# EAGLE design OpenPCR-combined-blockfront (EAGLE 6.2)
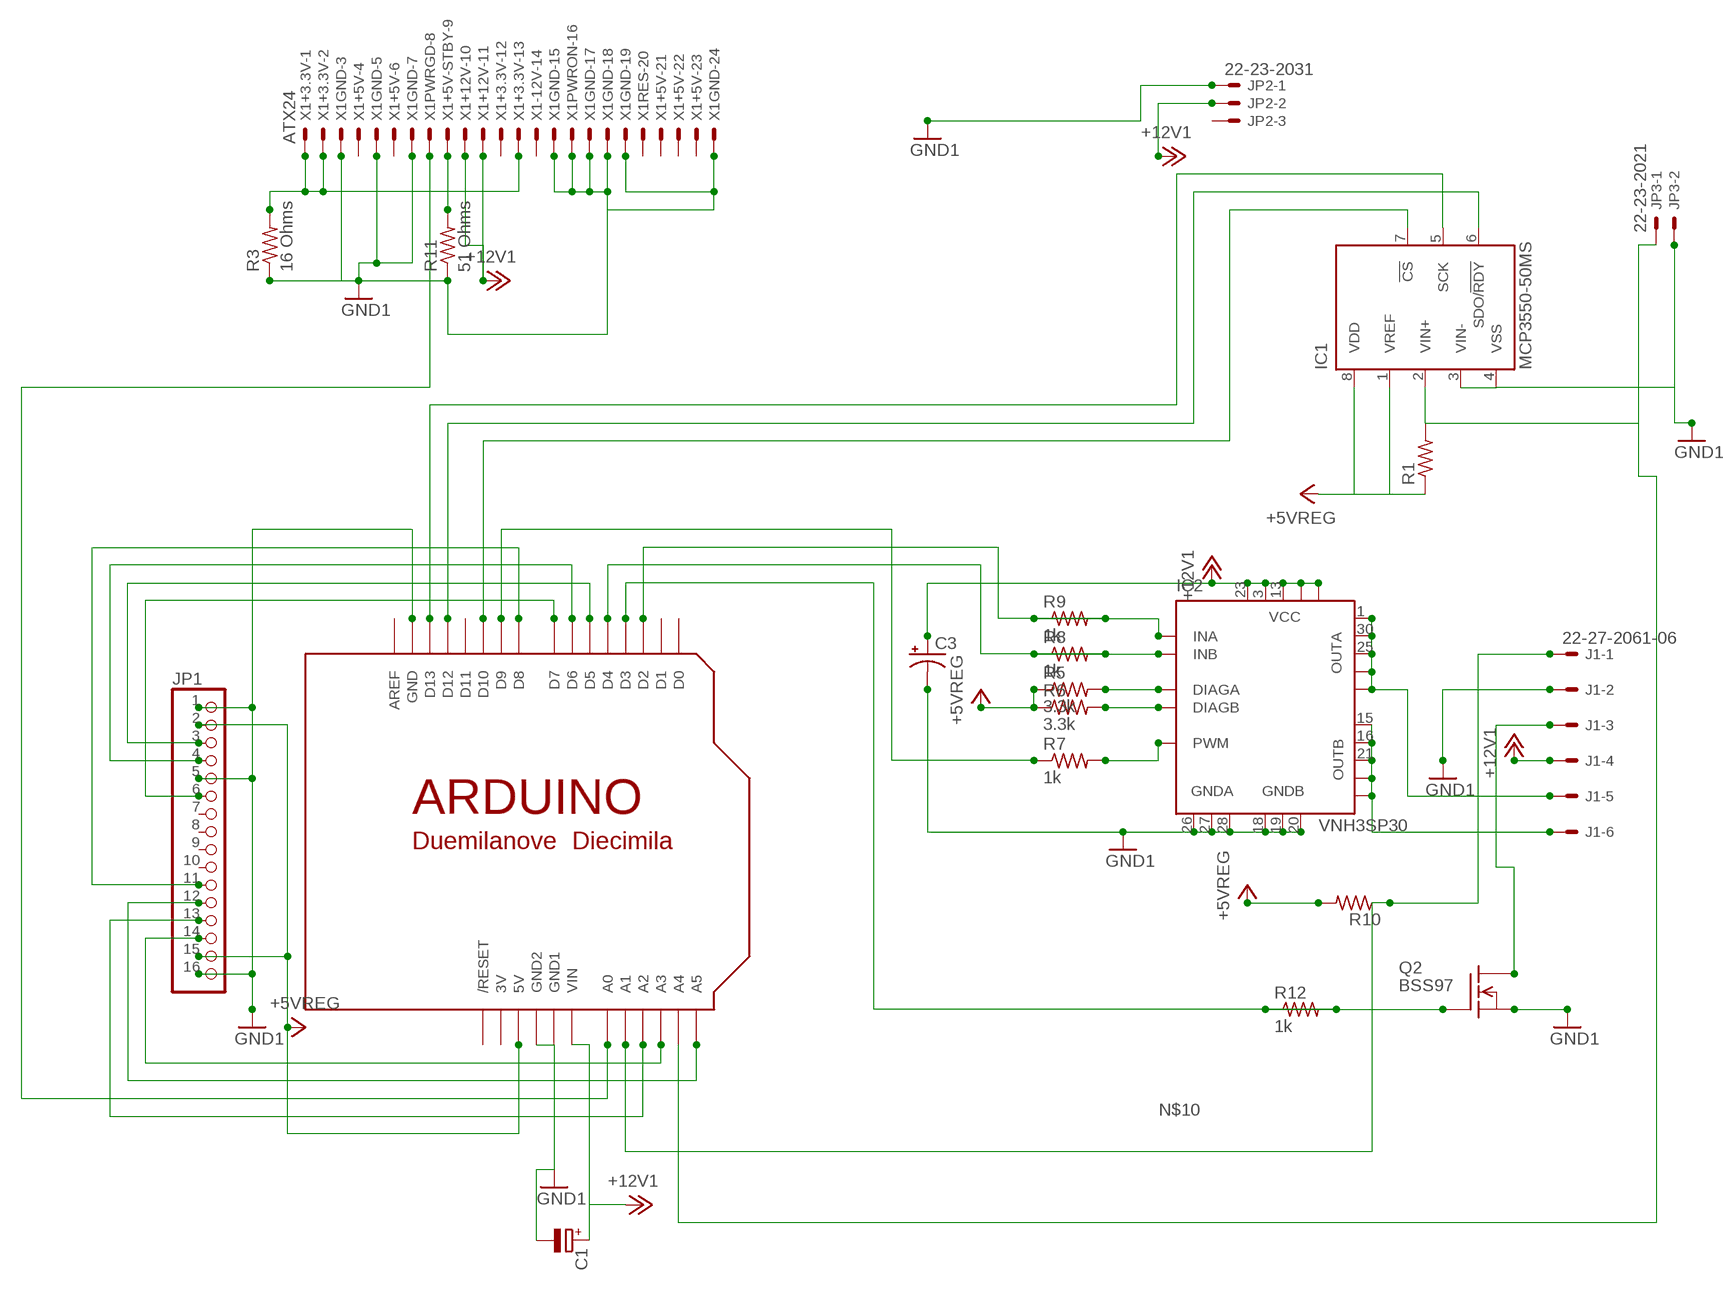
[diagram p0: schematic, sheet 1]

## Parts
C1  CPOL-EUE5-8.5  [E5-8,5]
C3  CPOL-USE5-13  [E5-13]
IC1  MCP3550-50MS  [MSOP8]
IC2  VNH3SP30  [MULTIPOWERSO-30]
J1  22-27-2061-06  [6410-06]
JP1  PINHD-1X16/90  [1X16/90]
JP2  22-23-2031  [22-23-2031]
JP3  22-23-2021  [22-23-2021]
Q2  BSS97  [TO202]
R1  R-US_0207/10  [0207/10]
R3  16 Ohms  R-US_0414/15  [0414/15]
R5  3.3k  R-US_R0603  [R0603]
R6  3.3k  R-US_R0603  [R0603]
R7  1k  R-US_R0603  [R0603]
R8  1k  R-US_R0603  [R0603]
R9  1k  R-US_R0603  [R0603]
R10  R-US_0207/10  [0207/10]
R11  51 Ohms  R-US_0207/12  [0207/12]
R12  1k  R-US_R0603  [R0603]
U$3  ARDUINODUEMILANOVE  [ARDUINO]
X1  ATX24  [ATX24]

## Nets
+3.3V [2A]: R3.2 X1.1 X1.2 X1.13
+5VREG [2A]: IC1.1(VREF) IC1.8(VDD) JP1.2 JP1.15 R1.1 R5.1 R6.1 R10.2 U$3.5V
+5VSTBY: R11.2 X1.9
+12V1: C1.+ C3.+ IC2.3(VCC) IC2.13(VCC) IC2.23(VCC) IC2.VCC IC2.VCC@1(VCC) J1.4 JP2.2 U$3.VIN X1.10 X1.11
GND1: C1.- C3.- IC1.3(VIN-) IC1.4(VSS) IC2.18(GNDB) IC2.19(GNDB) IC2.20(GNDB) IC2.26(GNDA) IC2.27(GNDA) IC2.28(GNDA) J1.2 JP1.1 JP1.5 JP1.16 JP2.1 JP3.2 Q2.1(S) R3.1 R11.1 U$3.GND U$3.GND1 U$3.GND2 X1.3 X1.5 X1.7 X1.15 X1.16 X1.17 X1.18 X1.19 X1.24
N$1: U$3.A0 X1.8
N$2: JP1.3 U$3.D5
N$3: JP1.4 U$3.D6
N$4: JP1.14 U$3.A3
N$6: IC2.11(INB) R8.1
N$8: R12.2 U$3.D3
N$10: JP1.13 U$3.A2
N$11: JP1.6 U$3.D7
N$12: JP1.12 U$3.A5
N$14: IC1.5(SCK) U$3.D13
N$16: IC2.8(PWM) R7.2
N$18 [3A]: J1.3 Q2.2(D)
N$19: IC2.5(INA) R9.1
N$20: JP1.11 U$3.D8
N$22: IC1.2(VIN+) JP3.1 R1.2 U$3.A4
N$25 [2A]: IC2.1(OUTA) IC2.25(OUTA) IC2.30(OUTA) IC2.OUTA IC2.OUTA@1(OUTA) J1.5
N$27: IC1.6(SDO/!RDY) U$3.D12
N$29: IC1.7(!CS) U$3.D10
N$30: R7.1 U$3.D9
N$31: R8.2 U$3.D4
N$32 [8A]: IC2.15(OUTB) IC2.16(OUTB) IC2.21(OUTB) IC2.OUTB IC2.OUTB@1(OUTB) J1.6
N$33: R9.2 U$3.D2
N$34: IC2.6(DIAGA) R5.2
N$35: IC2.10(DIAGB) R6.2
N$37: J1.1 R10.1 U$3.A1
T1: Q2.3(G) R12.1
Unconnected: JP1.7 JP1.8 JP1.9 JP1.10 JP2.3 U$3.AREF U$3.D0 U$3.D1 U$3.D11 U$3.RESET(/RESET) X1.4 X1.6 X1.12 X1.14 X1.20 X1.21 X1.22 X1.23

## Power pins joined to a net without a drawn wire
3V: U$3.3V

## Library data of the parts
C1 = rcl:CPOL-EU: POLARIZED CAPACITOR, European symbol
C3 = rcl:CPOL-US: POLARIZED CAPACITOR, American symbol
IC1 = microchip:MCP355*: Low-Power, Single-Channel 22-Bit Delta-Sigma ADCs Source: http://ww1.microchip.com/downloads/en/DeviceDoc/21950c.pdf; MF: MICROCHIP; MPN: MCP3550-50E/MS; OC_FARNELL: 1627198; OC_NEWARK: 69K0130
IC2 = st-microelectronics:VNH3SP30: FULLY INTEGRATED H-BRIDGE MOTOR DRIVER Source: http://pdf1.alldatasheet.com/datasheet-pdf/view/84563/STMICROELECTRONICS/VNH3SP30.html; MPN: VNH3SP30-E; OC_FARNELL: 1739420; OC_NEWARK: 33R1486
J1 = con-molex:22-?-06: CONNECTOR wire to board 2.54 mm (.1 inch) pitch header; OC_FARNELL: unknown; OC_NEWARK: unknown
JP1 = pinhead:PINHD-1X16: PIN HEADER
JP2 = con-molex:22-23-2031: .100" (2.54mm) Center Header - 3 Pin; MF: MOLEX; MPN: 22-23-2031; OC_FARNELL: 1462950; OC_NEWARK: 30C0862
JP3 = con-molex:22-23-2021: .100" (2.54mm) Center Header - 2 Pin; MF: MOLEX; MPN: 22-23-2021; OC_FARNELL: 1462926; OC_NEWARK: 25C3832
Q2 = openpcr:BSS97: N-Channel Enhancement MOSFET 200V; 1.5A; 1,6Ohm
R1 R3 R10 = resistor:R-US_: RESISTOR, American symbol
R5-R9 R11 R12 = rcl:R-US_: RESISTOR, American symbol
U$3 = openpcr:ARDUINO: Arduino Diecimila/Duemilanove Make a shield with ease, this package has all the named pins as well as the two mounting drill holes and an outline of the USB and DC power connector. The outline is on the DIMENSION layer, so if your board house uses it they will cut the outline to match. http://www.ladyada.net/library/pcb/eaglelibrary.html
X1 = openpcr:ATX24: Mini FIT connector 24 pol Source: http://www.molex.com; OC_FARNELL: unknown; OC_NEWARK: unknown

## Net classes
0 default: width 0.381 mm
1 2A: width 0.762 mm
2 8A: width 2.54 mm
3 3A: width 1.016 mm

## Board
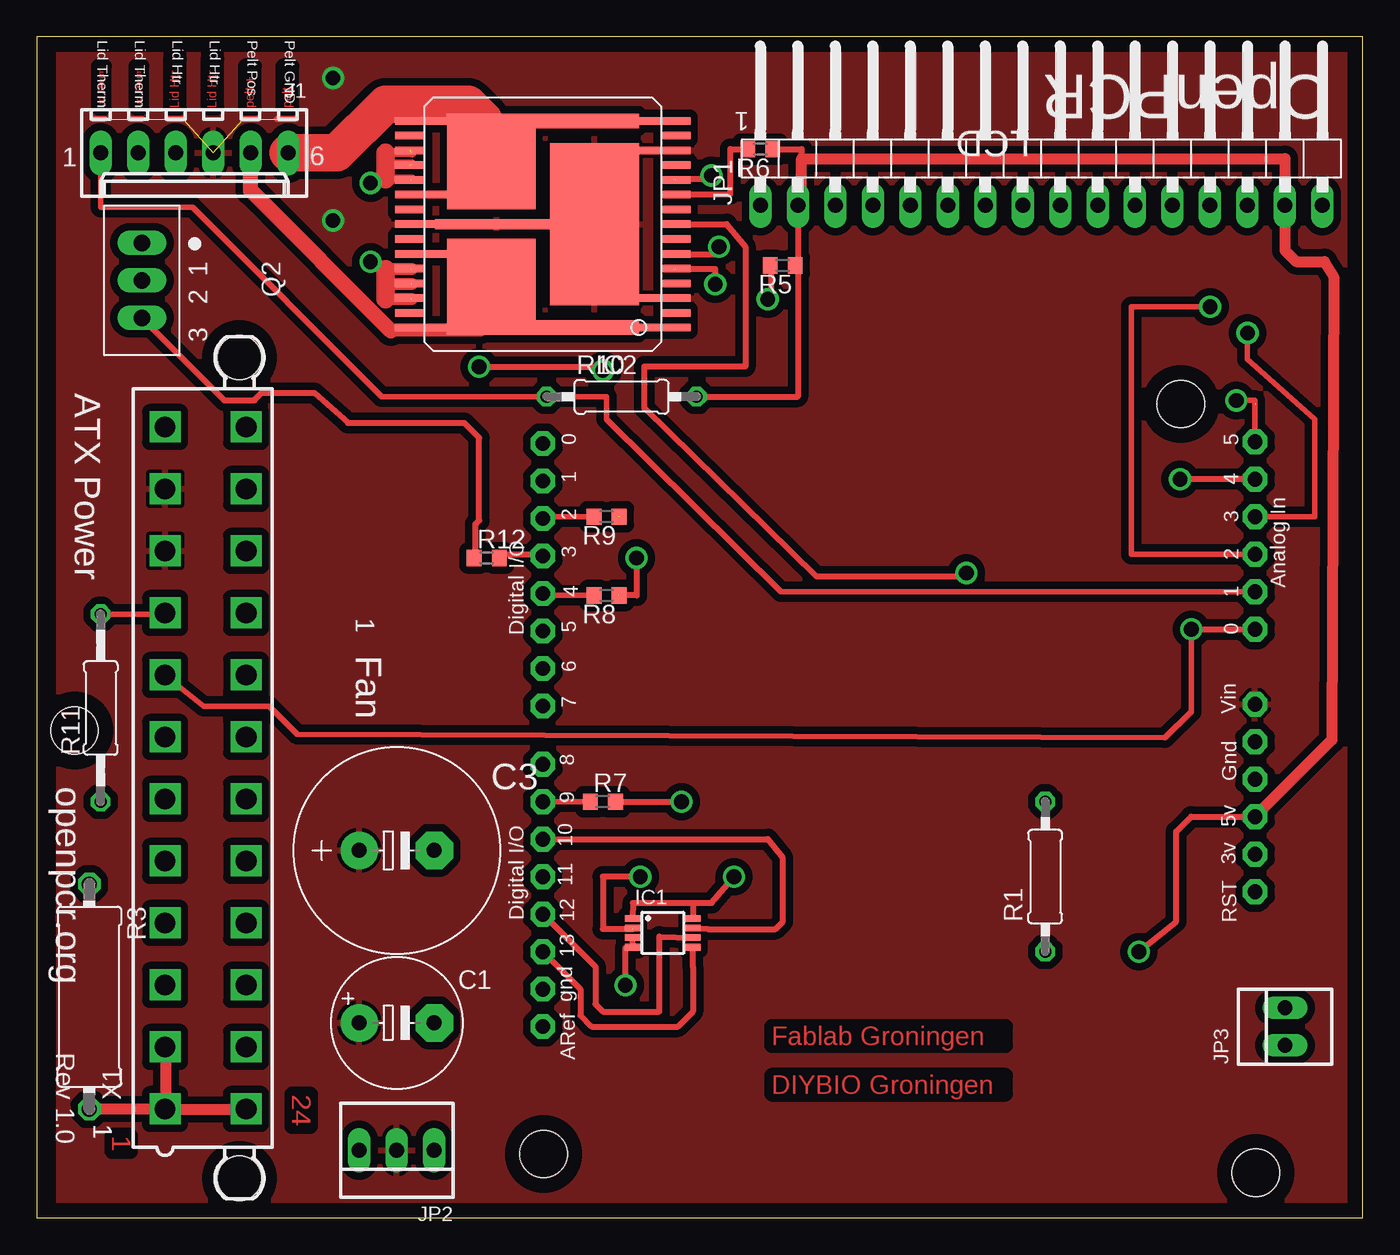
[diagram p1: board, top side]
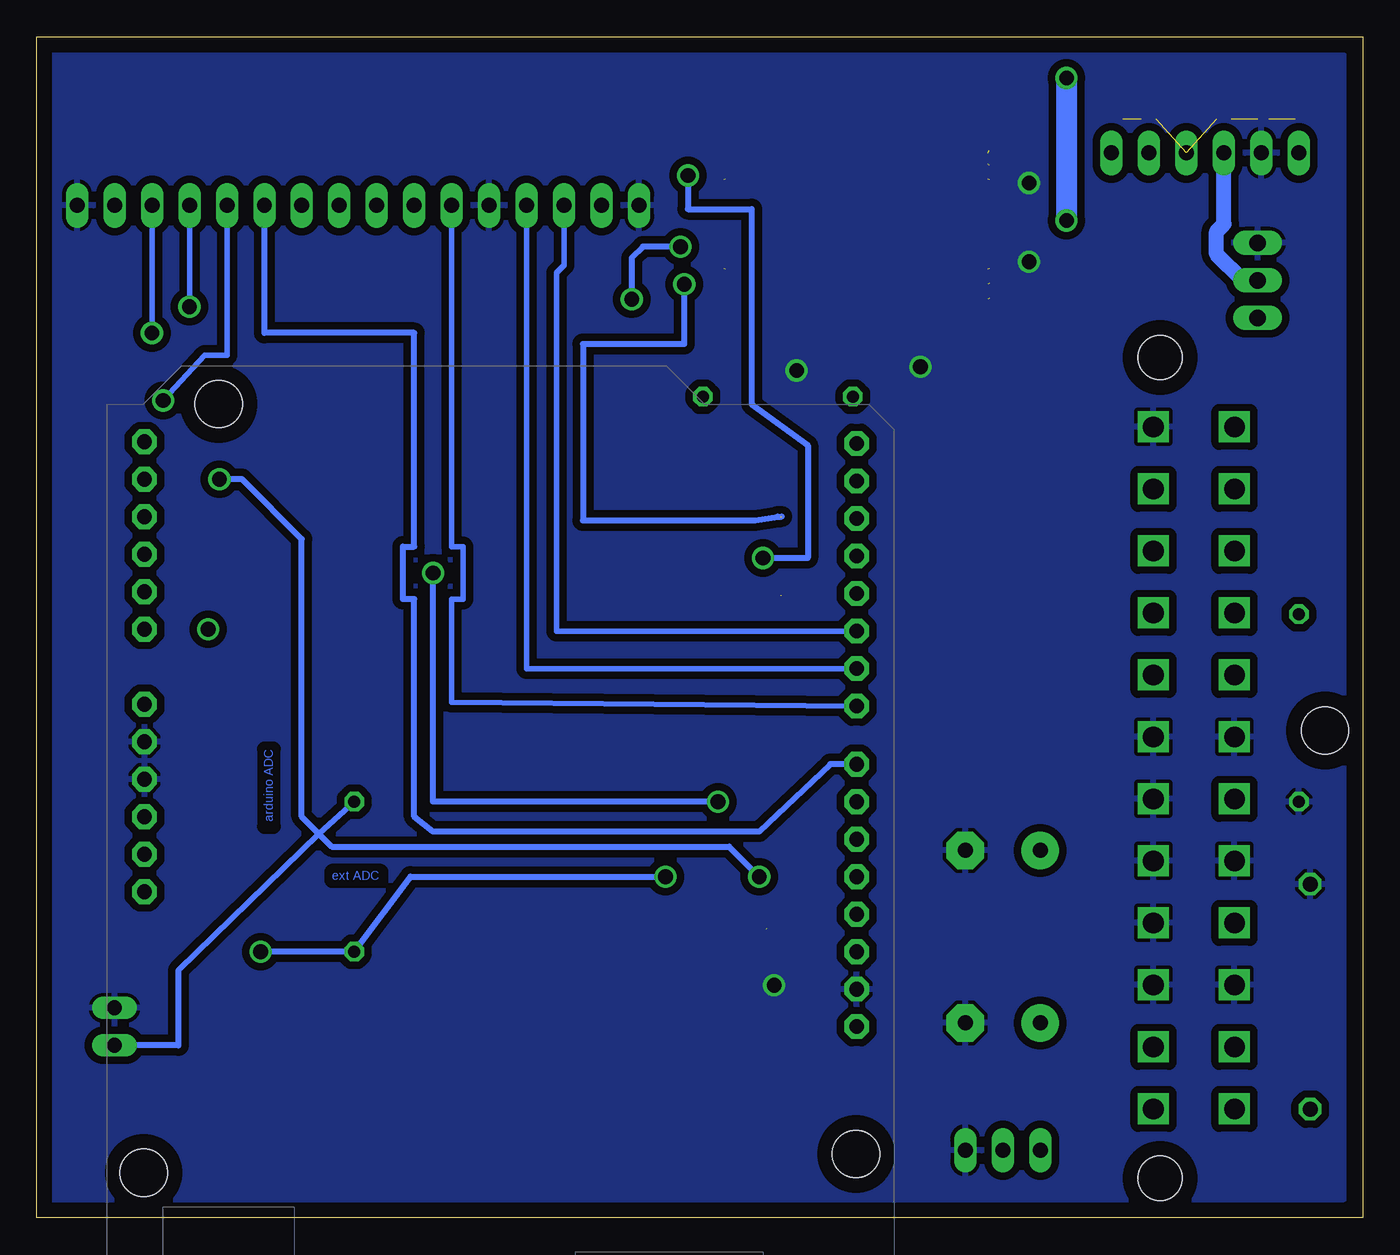
[diagram p2: board, bottom side, seen from below]

Size 89.84 x 80 mm. Coordinates in mm from the lower left corner, seen from the top.
Outline: 0,0 89.84,0 89.84,80 0,80 0,0
Copper layers (1*16): Top 0.035mm / dielectric 1.5mm / Bottom 0.035mm
Design rules: minimum track width 10mil, minimum drill 1mm, track to track 20mil, track to pad 20mil, pad to pad 8mil, via to via 8mil, smd to smd 8mil, copper to edge 40mil, drill to drill 8mil, minimum pad ring 10mil, minimum via ring 8mil, stop-mask expansion 4mil, vias tented up to drill 0mil, thermal gap 10mil
Holes 3.2 mm at 2.54,33.02

### Footprints (pad centres in the part's own frame; a part is rotated, then mirrored left to right if it is on the bottom)
E5-8,5 = drill 1.016 pad 2.54: + -2.54,0 | drill 1.016 pad 2.54 octagon: - 2.54,0
E5-13 = drill 1.016 pad 2.54: + -2.54,0 | drill 1.016 pad 2.54 octagon: - 2.54,0
MSOP8 = smd 0.45 x 1: 1 -0.975,-2.05; 2 -0.325,-2.05; 3 0.325,-2.05; 4 0.975,-2.05; 5 0.975,2.05; 6 0.325,2.05; 7 -0.325,2.05; 8 -0.975,2.05
MULTIPOWERSO-30 = smd 0.508 x 12: 1 -7,-4; 15 7,-4; 16 7,4; 30 -7,4 | smd 0.508 x 2: 2 -6,-9; 4 -4,-9; 5 -3,-9; 6 -2,-9; 7 -1,-9; 8 0,-9; 9 1,-9; 10 2,-9; 11 3,-9; 12 4,-9; 14 6,-9; 17 6,9; 18 5,9; 19 4,9; 20 3,9; 22 1,9; 24 -1,9; 26 -3,9; 27 -4,9; 28 -5,9; 29 -6,9 | smd 0.508 x 4: 3 -5,-8; 13 5,-8; 21 2,8; 23 0,8; 25 -2,8 | smd 6.5 x 6: OUTA -4.25,3.5; OUTB 4.25,3.5 | smd 1 x 7.5: OUTA@1 -7,-2.755; OUTB@1 7,-2.755 | smd 11 x 6: VCC 0,-3.5 | smd 0.65 x 8.3: VCC@1 0,3.145
6410-06 = drill 1.016 long: 1 6.35,0; 2 3.81,0; 3 1.27,0; 4 -1.27,0; 5 -3.81,0; 6 -6.35,0
1X16/90 = drill 1.016 long: 1 -19.05,-3.81; 2 -16.51,-3.81; 3 -13.97,-3.81; 4 -11.43,-3.81; 5 -8.89,-3.81; 6 -6.35,-3.81; 7 -3.81,-3.81; 8 -1.27,-3.81; 9 1.27,-3.81; 10 3.81,-3.81; 11 6.35,-3.81; 12 8.89,-3.81; 13 11.43,-3.81; 14 13.97,-3.81; 15 16.51,-3.81; 16 19.05,-3.81
22-23-2031 = drill 1 long: 1 -2.54,0; 2 0,0; 3 2.54,0
22-23-2021 = drill 1 long: 1 -1.27,0; 2 1.27,0
TO202 = drill 1.118 long: 1 -2.54,-5.08; 2 0,-5.08; 3 2.54,-5.08
0207/10 = drill 0.813 octagon: 1 -5.08,0; 2 5.08,0
0414/15 = drill 1.016 octagon: 1 -7.62,0; 2 7.62,0
R0603 = smd 1 x 1.1: 1 -0.85,0; 2 0.85,0
0207/12 = drill 0.813 octagon: 1 -6.35,0; 2 6.35,0
ARDUINO = drill 1 pad 1.676 octagon: 3V 36.068,2.54; 5V 38.608,2.54; A0 51.308,2.54; A1 53.848,2.54; A2 56.388,2.54; A3 58.928,2.54; A4 61.468,2.54; A5 64.008,2.54; AREF 24.384,50.8; D0 63.881,50.8; D1 61.341,50.8; D2 58.801,50.8; D3 56.261,50.8; D4 53.721,50.8; D5 51.181,50.8; D6 48.641,50.8; D7 46.101,50.8; D8 42.164,50.8; D9 39.624,50.8; D10 37.084,50.8; D11 34.544,50.8; D12 32.004,50.8; D13 29.464,50.8; GND 26.924,50.8; GND1 43.688,2.54; GND2 41.148,2.54; RESET 33.528,2.54; VIN 46.228,2.54 | hole 3.2: 15.758,50.754; 66.558,7.574; 14.488,2.494
ATX24 = drill 1.4 square: 1 23.1,-2.75; 2 18.9,-2.75; 3 14.7,-2.75; 4 10.5,-2.75; 5 6.3,-2.75; 6 2.1,-2.75; 7 -2.1,-2.75; 8 -6.3,-2.75; 9 -10.5,-2.75; 10 -14.7,-2.75; 11 -18.9,-2.75; 12 -23.1,-2.75; 13 23.1,2.75; 14 18.9,2.75; 15 14.7,2.75; 16 10.5,2.75; 17 6.3,2.75; 18 2.1,2.75; 19 -2.1,2.75; 20 -6.3,2.75; 21 -10.5,2.75; 22 -14.7,2.75; 23 -18.9,2.75; 24 -23.1,2.75 | hole 3: 27.8,2.29; -27.8,2.29

### Placement (x,y rotation side)
C1  24.38,13.21 0 top
C3  24.38,24.89 0 top
IC1  42.42,19.3 270 top
IC2  34.29,67.31 90 top
J1  10.67,72.14 180 top
JP1  68.07,72.39 0 top
JP2  24.38,4.57 180 top
JP3  84.58,12.95 90 top
Q2  12.19,63.5 270 top
R1  68.33,23.11 90 top
R3  3.56,14.99 270 top
R5  50.55,64.52 180 top
R6  49.02,72.39 180 top
R7  38.35,28.19 0 top
R8  38.61,42.16 180 top
R9  38.61,47.5 180 top
R10  39.62,55.63 0 top
R11  4.32,34.54 90 top
R12  30.48,44.7 0 top
U$3  85.09,-11.43 90 top
X1  11.43,30.48 270 top

### Tracks (layer width: path | path; a pad name or v marks a point on that pad's centre or on a via)
+3.3V
  Top 0.762: R3.2 8.64,7.37 X1.1 | X1.2 8.76,11.56 8.76,7.75 X1.1 | X1.13 14.1,7.37 9.02,7.37 X1.1
+5VREG  (via drill 1)
  Top 0.406: 49.78,72.39 R6.1 51.82,72.39 JP1.2 51.56,64.52 | R10.2 51.56,55.63 51.56,64.52 | 51.56,64.52 R5.1 | 44.45,21.34 40.39,21.34 IC1.1 | v74.68,18.03 77.22,20.07 77.22,26.16 78.23,27.18 U$3.5V | v47.24,23.11 45.72,21.34 44.45,21.34 | 44.45,21.34 IC1.8
  Top 0.762: JP1.2 51.82,68.83 51.82,71.75 84.58,71.75 JP1.15 84.58,65.53 85.34,64.77 87.25,64.77 87.88,63.75 87.76,32.38 U$3.5V
  Bottom 0.406: v74.68,18.03 R1.1 64.52,23.11 v47.24,23.11
+5VSTBY
  Top 0.381: R11.2 8.64,40.89 X1.9
+12V1  (via drill 1)  (5 unrouted)
  Top 0.381: IC2.3 42.16,62.36 39.12,62.36 37.85,66.42 37.85,67.31 IC2.VCC
  Top 0.406: 17.53,74.42 16.26,74.42 | 14.99,74.42 13.97,74.42 | 9.91,74.42 8.89,74.42 | 7.11,74.42 6.35,74.42 | 4.57,74.42 3.81,74.42 | 26.42,67.31 IC2.23 26.42,67.31
  Bottom 1.422: v20.07,77.22 v20.07,67.56
  pour Top: 1.52,79.25 89.15,79.25 89.15,1.02 1.52,1.02
GND1  (via drill 1)  (6 unrouted)
  Top 0.406: 23.62,64.26 22.61,64.26 v22.61,64.77 | 23.62,70.36 22.61,70.36 v22.61,70.1 | v29.97,57.66 38.35,57.66 v38.35,57.4 | v39.88,15.75 39.88,18.29 | 39.88,18.29 40.39,18.29 IC1.3 | 39.88,18.29 IC1.4
  Top 0.61: 25.4,71.37 23.62,71.37 | 25.4,70.36 23.62,70.36 | 25.4,72.14 23.62,72.14
  Top 0.813: 25.4,63.25 23.62,63.25 | 25.4,62.23 23.62,62.23 | 25.4,64.26 23.62,64.26
  Top 1.27: 23.62,62.23 23.62,63.25 23.62,64.26 | 23.62,70.36 23.62,71.37 23.62,72.14
  pour Bottom (rank 3): 1.27,78.74 88.9,78.74 88.9,1.27 1.27,1.27
N$1  (via drill 1)
  Top 0.381: v78.23,39.88 78.23,34.29 76.45,32.51 17.65,32.77 15.75,34.67 11.3,34.67 8.76,36.7 X1.8
  Top 0.406: v78.23,39.88 U$3.A0
N$2
  Bottom 0.381: JP1.3 54.1,64.52 54.61,64.01 54.61,39.75 U$3.D5
N$3
  Bottom 0.381: JP1.4 56.64,37.21 U$3.D6
N$4  (via drill 1)
  Top 0.381: v82.04,59.94 82.04,58.17 82.3,57.91 86.61,54.1 86.61,47.5 U$3.A3
  Bottom 0.381: v82.04,59.94 JP1.14
N$6  (via drill 1)  (2 unrouted)
  Top 0.406: v45.72,70.61 45.72,70.36 43.18,70.36 | v40.64,44.7 40.64,42.16 39.37,42.16
  Bottom 0.406: v45.72,70.61 45.72,68.33 41.4,68.33 41.4,55.12 37.59,52.32 37.59,44.7 v40.64,44.7
N$8
  Top 0.406: U$3.D3 34.29,44.96 31.24,44.96 31.24,44.7 R12.2
N$10  (via drill 1)
  Top 0.381: v79.5,61.72 74.17,61.72 74.17,44.96 U$3.A2
  Bottom 0.381: v79.5,61.72 JP1.13
N$11
  Bottom 0.381: JP1.6 61.72,45.47 60.96,45.47 60.96,41.91 61.72,41.91 61.72,34.92 U$3.D7
N$12  (via drill 1)
  Top 0.381: U$3.A5 82.55,55.37 v81.28,55.37
  Bottom 0.381: JP1.12 76.96,58.42 78.49,58.42 v81.28,55.37
N$14
  Top 0.406: U$3.D13 36.83,15.49 36.83,13.72 37.59,12.95 43.43,12.95 44.45,13.97 44.45,17.02 IC1.5
N$16  (via drill 1)
  Top 0.406: v62.99,43.69 62.74,43.43 52.83,43.43 41.15,54.86 41.15,57.66 48.01,57.66 48.01,65.79 46.74,67.31 IC2.8 | v43.69,28.19 R7.2 39.12,28.19
  Bottom 0.406: v62.99,43.69 62.99,28.19 v43.69,28.19
N$18
  Bottom 1.016: J1.3 9.4,67.31 9.91,66.8 9.91,65.28 8.13,63.5 Q2.2
N$19  (via drill 1)  (2 unrouted)
  Top 0.406: v45.97,63.25 45.97,64.26 43.18,64.26
  Bottom 0.406: v45.97,63.25 45.97,59.18 52.83,59.18 52.83,47.24 41.15,47.24 39.62,47.5 39.37,47.5
N$20
  Bottom 0.406: JP1.11 74.42,59.94 64.26,59.94 64.26,45.47 65.02,45.47 65.02,41.91 64.26,41.91 64.26,27.18 62.99,26.16 40.89,26.16 36.07,30.73 U$3.D8
N$22  (via drill 1)  (1 unrouted)
  Top 0.406: v40.89,23.11 38.35,23.11 38.35,19.56 40.39,19.56 | U$3.A4 v77.47,50.04
  Bottom 0.406: v40.89,23.11 42.93,25.15 69.85,25.15 70.74,26.04 | R1.2 70.74,26.04 | JP3.1 80.26,11.68 80.26,16.76 70.74,26.04 | v77.47,50.04 75.95,50.04 71.88,45.97 71.88,27.18 70.74,26.04
N$25
  Top 0.406: IC2.OUTA 30.73,63.25 30.73,64.77 30.48,65.02 28.7,65.02 28.45,65.28 26.42,65.28 IC2.25
  Top 0.762: IC2.1 38.23,60.33 37.08,60.33 IC2.OUTA@1 36.7,60.33 30.61,60.33 IC2.OUTA 30.73,62.99 28.07,60.33 IC2.30 30.23,60.2 30.1,60.07 24,60.07
  Top 1.016: J1.5 14.48,69.6 24,60.07
N$27
  Top 0.406: IC1.6 42.16,19.05 42.16,13.97 38.35,13.97 37.85,14.48 37.85,17.02 U$3.D12
N$29
  Top 0.406: IC1.7 45.47,19.56 50.04,19.56 50.55,20.07 50.55,24.38 49.53,25.65 U$3.D10
N$30
  Top 0.381: U$3.D9 R7.1
N$31
  Top 0.381: R8.2 34.42,42.16 U$3.D4
N$32
  Top 0.406: IC2.OUTB 29.72,70.87 28.19,69.34 26.42,69.34 IC2.21 | IC2.15 38.1,74.42 37.08,74.42 IC2.OUTB@1 36.83,74.42 31.5,74.42 IC2.16
  Top 2.54: J1.6 20.32,72.14 23.62,75.44 29.21,75.44 30.23,74.42 IC2.16 30.73,73.15 30.73,71.63 IC2.OUTB
N$33
  Top 0.381: R9.2 34.42,47.5 U$3.D2
N$34  (via drill 1)
  Top 0.406: v49.53,62.23 49.78,62.23 49.78,64.52 R5.2 | v46.23,65.79 46.23,65.28 43.43,65.28 IC2.6
  Bottom 0.406: v46.23,65.79 48.77,65.79 49.53,65.02 v49.53,62.23
N$35
  Top 0.406: R6.2 46.99,72.39 46.99,69.34 43.43,69.34 IC2.10
N$37
  Top 0.381: J1.1 4.32,68.45 10.54,68.45 23.37,55.63 R10.1 38.61,55.63 38.61,54.1 50.42,42.42 U$3.A1
T1
  Top 0.406: R12.1 29.72,44.7 29.72,46.99 29.97,47.24 29.97,52.83 28.96,53.85 21.08,53.85 18.8,55.88 15.24,55.88 14.73,55.37 12.7,55.37 Q2.3

### Text on the board
Top: Lid Therm | Lid Therm | Lid Htr | Lid Htr | pelt + | pelt - | Fablab Groningen | 24 | DIYBIO Groningen | 1
Bottom: arduino ADC | ext ADC
_tsilk: Lid Therm | Lid Therm | Lid Htr | Lid Htr | Pelt Pos | Pelt GND | OpenPCR | 1 | LCD | ATX Power | 1 | Fan | openpcr.org | Rev 1.0 | 1 | 1